# EAGLE design BLAST_TNG_PSD (EAGLE 9.4.2)
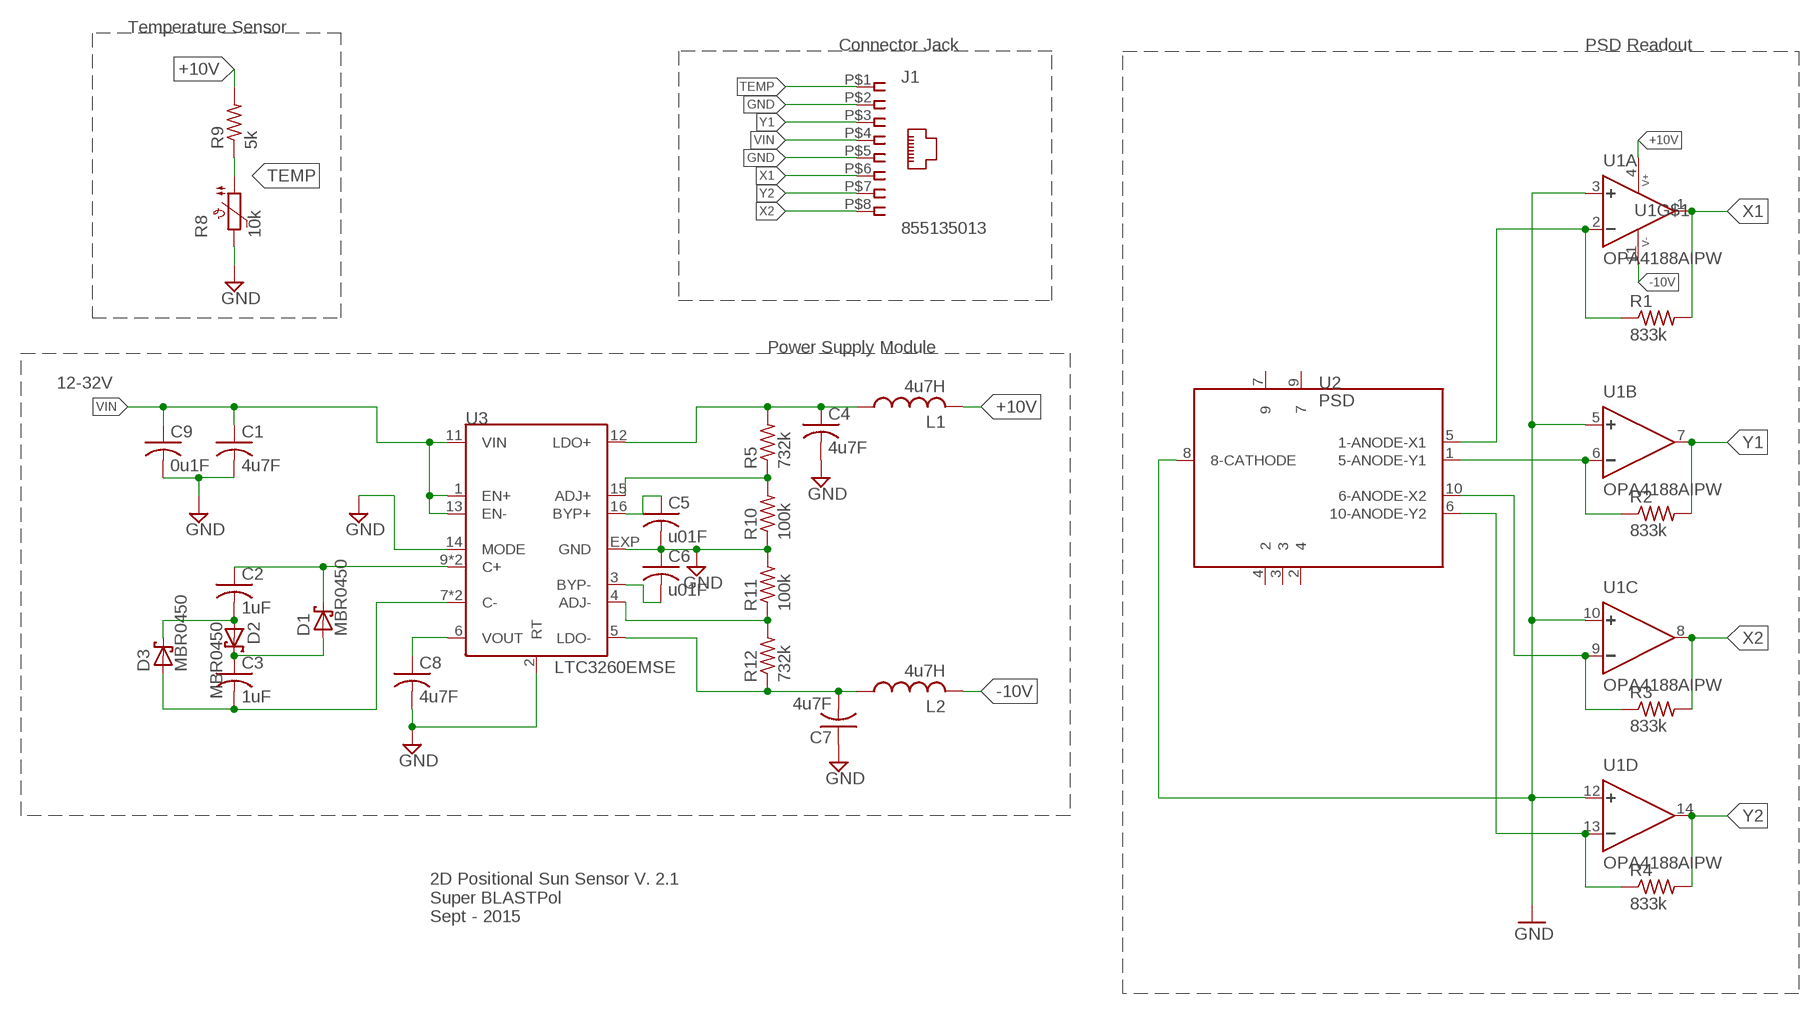
[diagram p0: schematic, sheet 1]

## Parts
C1  4u7F  C-USC1210  [C1210]
C2  1uF  C-USC1206  [C1206]
C3  1uF  C-USC1206  [C1206]
C4  4u7F  C-USC1210  [C1210]
C5  u01F  C-USC0805  [C0805]
C6  u01F  C-USC0805  [C0805]
C7  4u7F  C-USC1210  [C1210]
C8  4u7F  C-USC1210  [C1210]
C9  0u1F  C-USC0805  [C0805]
D1  MBR0450  [SOD123]
D2  MBR0450  [SOD123]
D3  MBR0450  [SOD123]
J1  855135013  [855135013]
L1  4u7H  L-USL2012C  [L2012C]
L2  4u7H  L-USL2012C  [L2012C]
R1  833k  R-US_M0805  [M0805]
R2  833k  R-US_M0805  [M0805]
R3  833k  R-US_M0805  [M0805]
R4  833k  R-US_M0805  [M0805]
R5  732k  R-US_R0805  [R0805]
R8  10k  VISHAY-TFPT1206  [L3216C]
R9  5k  R-US_R0805  [R0805]
R10  100k  R-US_R0805  [R0805]
R11  100k  R-US_R0805  [R0805]
R12  732k  R-US_R0805  [R0805]
U1  OPA4188AIPW  [TSSOP14]
U2  PSD  PSD-S5991  [PSD-S5991]
U3  LTC3260EMSE  [MSOP16]

## Nets
+10V [PWR]: L1.2 R9.2 U1.4(V+)
-10V: L2.2 U1.11(V-)
D1X1: R1.1 U1.2(A:-) U2.5(1-ANODE-X1)
D1X2: R3.1 U1.9(C:-) U2.10(6-ANODE-X2)
D1Y1: R2.1 U1.6(B:-) U2.1(5-ANODE-Y1)
D1Y2: R4.1 U1.13(D:-) U2.6(10-ANODE-Y2)
FLY+: C2.1 D1.C U3.9(C+) U3.10(C+)
FLY-: C3.2 D3.A U3.7(C-) U3.8(C-)
GND [GND]: C1.2 C4.2 C5.2 C6.1 C7.1 C8.2 C9.2 J1.P$2 J1.P$5 R8.2 R10.1 R11.2 U1.3(A:+) U1.5(B:+) U1.10(C:+) U1.12(D:+) U2.8(8-CATHODE) U3.2(RT) U3.14(MODE) U3.EXP(GND)
LDO+ [PWR]: C4.1 L1.1 R5.2 U3.12(LDO+)
LDO-: C7.2 L2.1 R12.1 U3.5(LDO-)
N$4: C8.1 U3.6(VOUT)
N$5: C3.1 D1.A D2.C
N$8: C2.2 D2.A D3.C
N$10: C6.2 U3.3(BYP-)
N$11: C5.1 U3.16(BYP+)
N$12: R5.1 R10.2 U3.15(ADJ+)
N$13: R11.1 R12.2 U3.4(ADJ-)
TEMP: J1.P$1 R8.1 R9.1
VIN [PWR]: C1.1 C9.1 J1.P$4 U3.1(EN+) U3.11(VIN) U3.13(EN-)
X1: J1.P$6 R1.2 U1.1(A:OUT)
X2: J1.P$8 R3.2 U1.8(C:OUT)
Y1: J1.P$3 R2.2 U1.7(B:OUT)
Y2: J1.P$7 R4.2 U1.14(D:OUT)
Unconnected: U2.2 U2.3 U2.4 U2.7 U2.9

## Notes on the sheet
- Temperature Sensor
- Connector Jack | PSD Readout
- Power Supply Module
- 12-32V
- 2D Positional Sun Sensor V. 2.1
  Super BLASTPol
  Sept - 2015

## Library data of the parts
C1 C4 C7 C8 = rcl:C-US: CAPACITOR, American symbol; MPN: CL31A475KOHNNNE; OC_NEWARK: 82AC9497
C2 C3 C5 C6 C9 = rcl:C-US: CAPACITOR, American symbol; OC_NEWARK: unknown
D1-D3 = diode:MBR0450; OC_NEWARK: unknown
J1 = con-molex:855135013; MPN: 85513-5013; OC_NEWARK: 42M3080
L1 L2 = rcl:L-US: INDUCTOR, American symbol; OC_NEWARK: unknown
R1-R4 = adafruit:R-US_: RESISTOR, American symbol; OC_NEWARK: unknown
R5 R9-R12 = rcl:R-US_: RESISTOR, American symbol; OC_NEWARK: unknown
R8 = sunsensor:VISHAY-TFPT; MPN: KPTL-3216CGCK; OC_NEWARK: 46W4593
U1 = texas:OPA4188: Zero-Drift OPERATIONAL AMPLIFIER http://www.ti.com/lit/ds/symlink/opa4188.pdf; OC_NEWARK: unknown
U2 = sunsensor:PSD-S5991; OC_NEWARK: unknown
U3 = linear-technology:LTC3260: Low Noise Dual Supply Inverting Charge Pump https://cds.linear.com/docs/en/datasheet/3260fa.pdf; OC_NEWARK: unknown

## Net classes
0 default: width 0.152 mm, drill 0.152 mm, clearance 0.152 mm
1 GND: width 0.152 mm, drill 0.152 mm, clearance 0.152 mm to class 0, clearance 0.152 mm
2 PWR: width 0.152 mm, drill 0.152 mm, clearance 0.152 mm to class 0, clearance 0.152 mm to class 1, clearance 0.152 mm

## Board
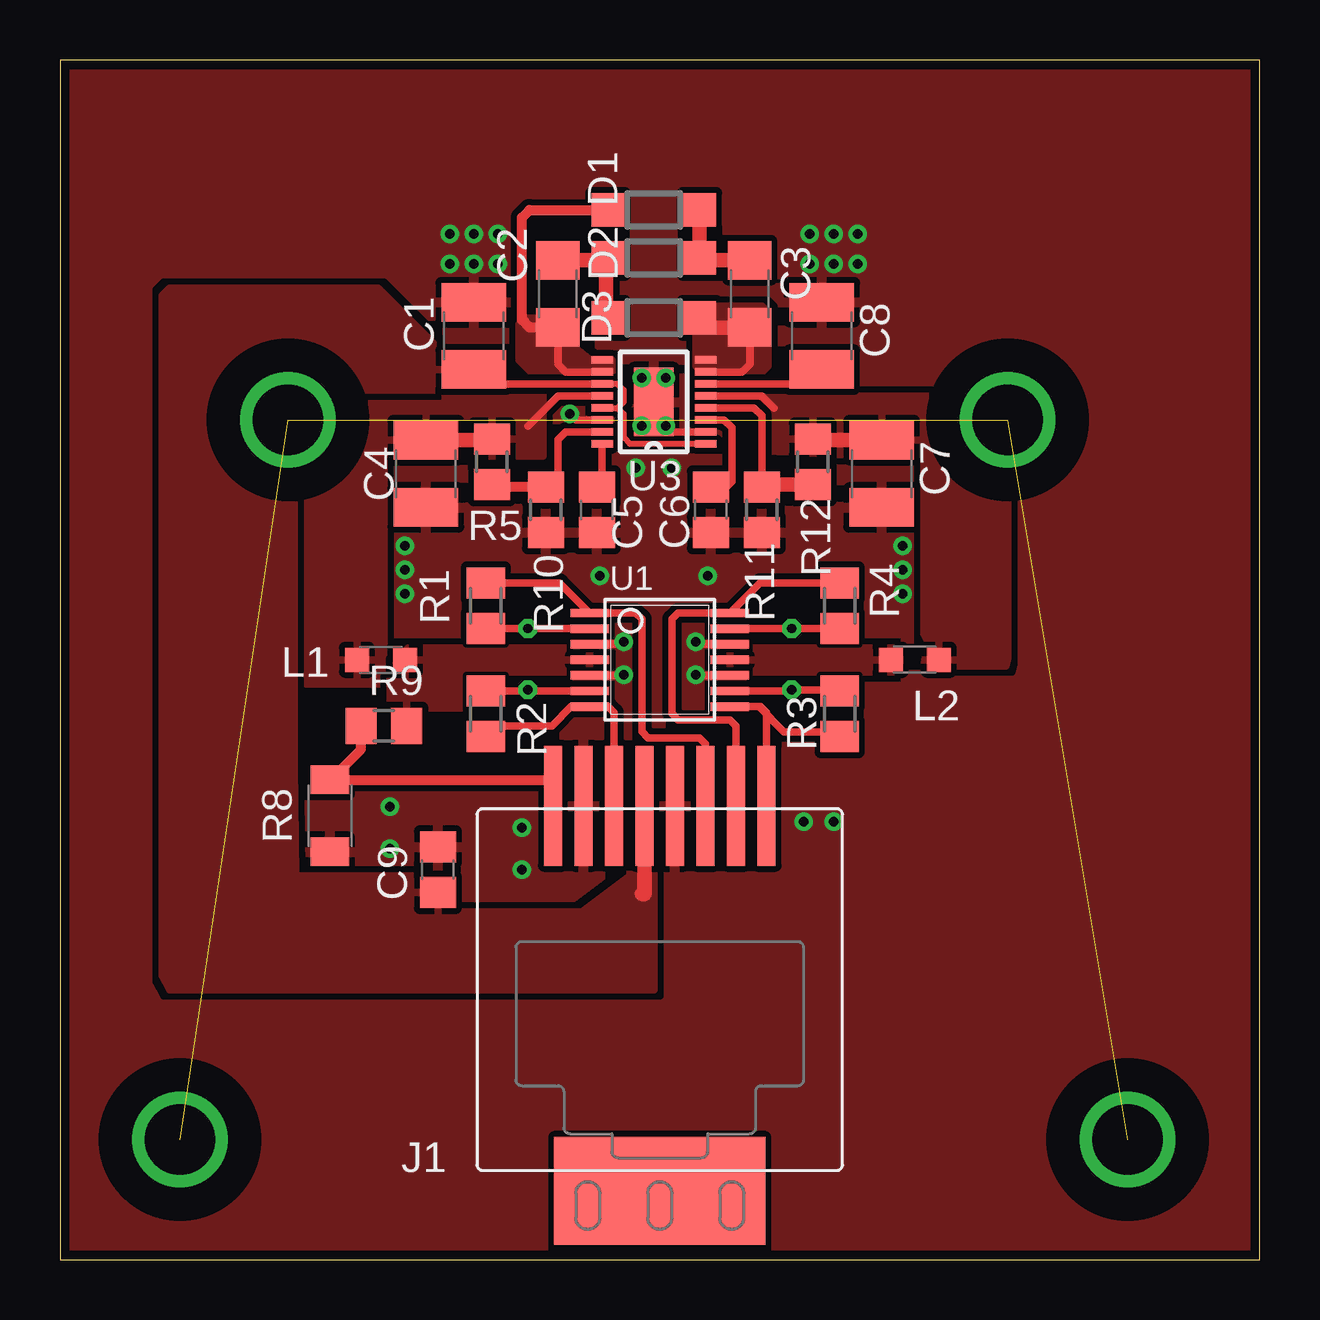
[diagram p1: board, top side]
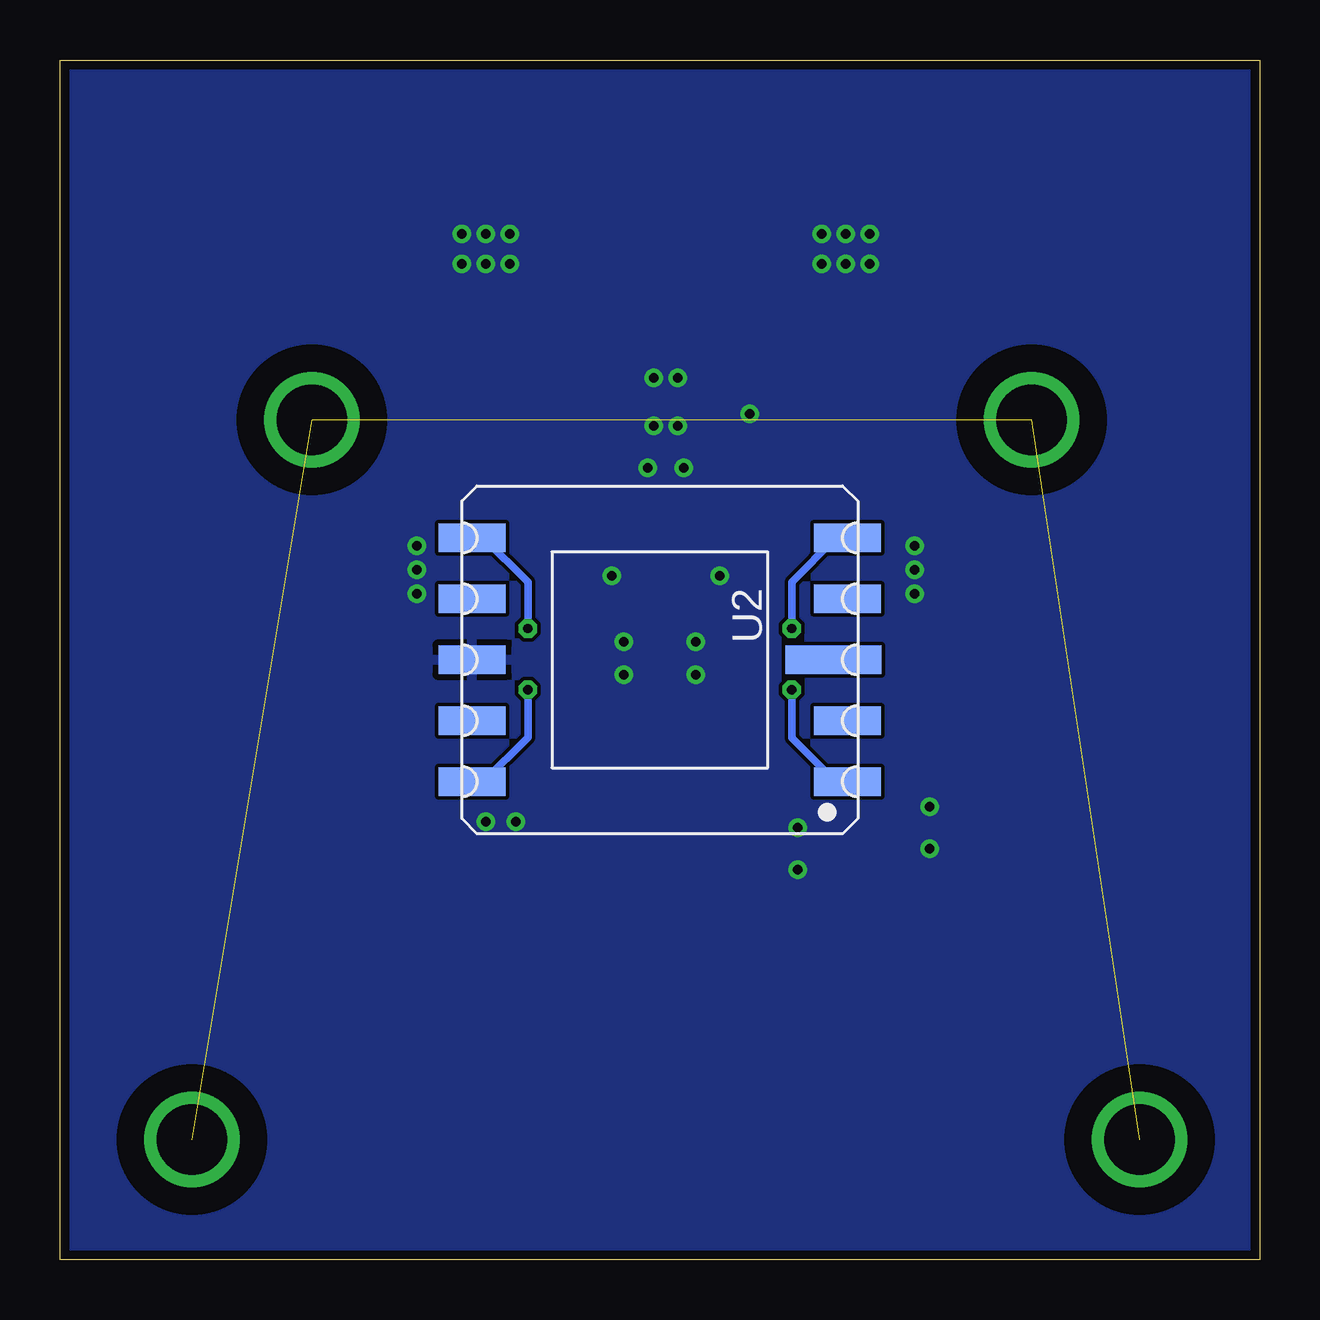
[diagram p2: board, bottom side, seen from below]

Size 50 x 50 mm. Coordinates in mm from the lower left corner, seen from the top.
Outline: 0,0 50,0 50,50 0,50 0,0
Copper layers (1*16): Top 0.035559375mm / dielectric 1.501140625mm / Bottom 0.035559375mm
Design rules "typical_4pcb": minimum track width 10mil, minimum drill 15mil, track to track 6mil, track to pad 6mil, pad to pad 6mil, via to via 6mil, smd to smd 6mil, copper to edge 15mil, drill to drill 8mil, minimum pad ring 10mil, minimum via ring 8mil, stop-mask expansion 4mil, vias tented up to drill 0mil, thermal gap 10mil
tRestrict: area 6.5,32 to 12.5,38; area 7.5,33 to 11.5,37; area 36.5,32 to 42.5,38; area 37.5,33 to 41.5,37; area 2,2 to 8,8; area 3,3 to 7,7; area 41.5,2 to 47.5,8; area 42.5,3 to 46.5,7
bRestrict: area 2,2 to 8,8; area 41.5,2 to 47.5,8; area 36.5,32 to 42.5,38; area 6.5,32 to 12.5,38

### Footprints (pad centres in the part's own frame; a part is rotated, then mirrored left to right if it is on the bottom)
C1210 = smd 1.6 x 2.7: 1 -1.4,0; 2 1.4,0
C1206 = smd 1.6 x 1.8: 1 -1.4,0; 2 1.4,0
C0805 = smd 1.3 x 1.5: 1 -0.95,0; 2 0.95,0
SOD123 = smd 1.4 x 1.4: A 1.9,0; C -1.9,0
855135013 = smd 0.76 x 5: P$1 4.445,-7.66; P$2 3.175,-7.66; P$3 1.905,-7.66; P$4 0.635,-7.66; P$5 -0.635,-7.66; P$6 -1.905,-7.66; P$7 -3.175,-7.66; P$8 -4.445,-7.66 | smd 8.8 x 4.5: STRAIN_REL 0,8.39
L2012C = smd 1 x 1: 1 -1,0; 2 1,0
M0805 = smd 1.3 x 1.6: 1 -0.95,0; 2 0.95,0
R0805 = smd 1.3 x 1.5: 1 -0.95,0; 2 0.95,0
L3216C = smd 1.2 x 1.6: 1 -1.5,0; 2 1.5,0
TSSOP14 = smd 0.35 x 1.6: 1 -1.95,-2.918; 2 -1.3,-2.918; 3 -0.65,-2.918; 4 0,-2.918; 5 0.65,-2.918; 6 1.3,-2.918; 7 1.95,-2.918; 8 1.95,2.918; 9 1.3,2.918; 10 0.65,2.918; 11 0,2.918; 12 -0.65,2.918; 13 -1.3,2.918; 14 -1.95,2.918
PSD-S5991 = smd 1.2 x 2.8: 1 5.08,7.823; 2 2.54,7.823; 4 -2.54,7.823; 5 -5.08,7.823; 6 -5.08,-7.823; 7 -2.54,-7.823; 8 0,-7.823; 9 2.54,-7.823; 10 5.08,-7.823 | smd 1.2 x 4: 3 0,7.239
MSOP16 = smd 0.889 x 0.305: 1 -2.163,1.75; 2 -2.163,1.25; 3 -2.163,0.75; 4 -2.163,0.25; 5 -2.163,-0.25; 6 -2.163,-0.75; 7 -2.163,-1.25; 8 -2.163,-1.75; 9 2.15,-1.75; 10 2.15,-1.25; 11 2.15,-0.75; 12 2.15,-0.25; 13 2.15,0.25; 14 2.15,0.75; 15 2.15,1.25; 16 2.15,1.75 | smd 1.65 x 2.85: EXP 0,0

### Placement (x,y rotation side)
C1  17.25,38.5 90 top
C2  20.75,40.25 90 top
C3  28.75,40.25 270 top
C4  15.25,32.75 270 top
C5  22.38,31.25 270 top
C6  27.12,31.25 90 top
C7  34.25,32.75 90 top
C8  31.75,38.5 90 top
C9  15.75,16.25 90 top
D1  24.75,43.75 0 top
D2  24.75,41.75 180 top
D3  24.75,39.25 0 top
J1  25,11.25 180 top
L1  13.38,25 0 top
L2  35.62,25 180 top
R1  17.75,27.25 90 top
R2  17.75,22.75 270 top
R3  32.5,22.75 270 top
R4  32.5,27.25 90 top
R5  18,33.25 90 top
R8  11.25,18.5 270 top
R9  13.5,22.25 0 top
R10  20.25,31.25 90 top
R11  29.25,31.25 270 top
R12  31.38,33.25 270 top
U1  25,25 270 top
U2  25,25 270 bottom
U3  24.75,35.75 180 top

### Tracks (layer width: path | path; a pad name or v marks a point on that pad's centre or on a via)
+10V
  pour Top: 14.5,25.5 22.75,25.5 22.75,24.5 16.75,24.5 16.75,23 13.75,23 13.75,24.5
-10V
  pour Top: 35,24.5 27.75,24.5 27.5,24.75 27.5,25.25 27.75,25.5 34.5,25.5 34.75,25.5 35,25.25
CASE4  (via drill 2.95)  (3 unrouted)
  other vias: 9.5,35 39.5,35 44.5,5 5,5
D1X1  (via drill 0.38 pad 0.3)
  Top 0.305: U1.2 v19.5,26.3 R1.1
  Bottom 0.305: 17.67,30.08 19.5,28.25 v19.5,26.3
  Bottom 0.406: U2.5 17.67,30.08
D1X2  (via drill 0.38 pad 0.3)
  Top 0.305: U1.9 30.45,23.7 v30.5,23.75 32.45,23.75 R3.1
  Bottom 0.305: 32.35,19.92 30.5,21.77 v30.5,23.75
  Bottom 0.406: U2.10 32.35,19.92
D1Y1  (via drill 0.38 pad 0.3)
  Top 0.305: U1.6 19.55,23.7 v19.5,23.75 19.45,23.7 R2.1
  Bottom 0.305: 17.67,19.92 19.5,21.75 v19.5,23.75
  Bottom 0.406: 17.67,19.92 U2.1
D1Y2  (via drill 0.38 pad 0.3)
  Top 0.305: R4.1 v30.5,26.3 U1.13
  Bottom 0.305: 32.35,30.08 30.5,28.23 v30.5,26.3
  Bottom 0.406: U2.6 32.35,30.08
FLY+
  Top 0.305: U3.10 21.07,37 20.75,37.32 C2.1
  Top 0.406: C2.1 19.57,38.85 19.25,39.17 19.25,43.43 19.57,43.75 D1.C
  pour Top (isolate 0.254, no thermals): 23,37 19.62,37 19.12,37.5 19.12,39 19.5,39.25 21.5,39.25 21.5,38 22.12,37.5 23,37.5
FLY-
  Top 0.305: U3.7 28.43,37 28.75,37.32 C3.2
  Top 0.61: D3.A 26.65,39.17 26.97,38.85 C3.2
  pour Top (isolate 0.254, no thermals): 26.5,37.25 26.5,39.5 26.75,39.75 29.25,39.75 29.5,39.5 29.5,37.25 29.25,37 26.75,37
GND  (via drill 0.38, 0.38 pad 0.3)
  Top 0.305: U3.2 24.75,34.5 24.75,35 | 24.75,35 U3.EXP | U1.3 23.5,25.65 v23.5,25.75 | U1.5 23.5,24.35 v23.5,24.38 | U1.12 26.6,25.65 v26.5,25.75 | U1.10 26.52,24.35 v26.5,24.38 | U3.14 21.5,35 v21.25,35.25 | v24.25,34.75 24.5,34.75 24.75,35
  other vias: 16.25,42.75 17.25,42.75 18.25,42.75 18.25,41.5 17.25,41.5 16.25,41.5 32.25,41.5 31.25,41.5 33.25,41.5 33.25,42.75 32.25,42.75 31.25,42.75 22.5,28.5 27,28.5 19.25,18 19.25,16.25 13.75,17.12 13.75,18.88 14.38,29.75 14.38,28.75 14.38,27.75 35.12,29.75 35.12,28.75 35.12,27.75 32.25,18.25 31,18.25 24.25,36.75 25.25,36.75 25.25,34.75 24,33 25.5,33
  pour Bottom: -2.02,52.34 57.15,53.34 57.15,-1.27 -2.77,-1.77
  pour Top (isolate 0.254, rank 6): -1.77,52.34 57.15,53.34 56.65,51.07 57.15,-1.27 -1.77,-1.27
LDO+
  Top 0.305: 19.5,34.75 20.75,36 U3.12
  Top 0.61: C4.1 17.95,34.15 R5.2
  pour Top (isolate 0.254, rank 2): 10.25,24 13.57,24 13.5,25.32 13.5,33.5 20.12,33.5 20.12,36.38 19.5,36.38 19,36.37 19,36 10.57,35.88 10.25,34.68
LDO-
  Top 0.305: U3.5 29.25,36 29.75,35.5
  Top 0.61: C7.2 31.43,34.15 R12.1
  pour Top (isolate 0.254): 36,24.75 39.43,24.75 39.5,25.07 39.5,34.18 38.68,36 30.75,36 30.75,36.25 30.5,36.5 27,36.5 27,33.82 33.57,33.5 35.68,33.5 36,33.18 36,26.07 36.18,25.75
N$4
  Top 0.305: U3.6 32.1,36.5
  Top 0.406: 32.1,36.5 C8.1
N$5
  Top 0.61: C3.1 26.75,41.65 D2.C D1.A
N$8
  Top 0.61: D2.A 22.75,41.65 | 22.75,41.65 C2.2 | 22.75,41.65 22.75,39.35 D3.C
N$10
  Top 0.305: U3.3 27.68,35 28,34.68 28,32.42 27.68,32.1 C6.2
N$11
  Top 0.305: C5.1 22.6,32.33 U3.16
N$12
  Top 0.305: U3.15 21.07,34.5 20.75,34.18 20.75,32.25
  Top 0.406: 20.75,32.25 20.3,32.25 R10.2 18.35,32.2 R5.1
N$13
  Top 0.305: R11.1 29.25,35.18 28.93,35.5 U3.4
  Top 0.61: R12.2 29.35,32.3 R11.1
TEMP
  Top 0.406: 20.55,19.25 J1.P$1 20.55,20 R8.1 11.28,20 12.55,21.27 R9.1
VIN
  Top 0.254: U3.1 23.75,34 23.5,34.25 23.5,35.25 23.25,35.5 | U3.13 23.25,35.5 | 23.25,35.5 23.5,35.75 23.5,36.25 23.25,36.5 U3.11
  Top 0.305: U3.11 17.4,36.5
  Top 0.406: 17.4,36.5 C1.1
  Top 0.61: J1.P$4 24.36,15.25 24.25,15.25
  pour Top (isolate 0.254): 15.93,37.25 16,37.25 16,38 15.75,38 13.25,40.5 4.57,40.5 4.25,40.18 4.25,11.82 4.57,11.25 24.75,11.25 24.75,16.93 24.68,17.25 23.88,17.12 23.75,16.75 23.75,16 21.75,14.5 16.5,14.5 15,16 9.82,16 9.75,20.57 9.75,35.18 10.32,36.25 16.5,36.25 16.5,36.93
X1
  Top 0.305: R1.2 20.83,28.2 U1.1 24,26.95 24.25,26.7 24.25,22 24.5,21.75 26.65,21.75 26.91,21.5 J1.P$6
X2
  Top 0.305: 29.13,23.05 28.75,23.05 U1.8 | R3.2 32.3,22 30.18,22 29.13,23.05 | J1.P$8 29.45,22.8 29.19,23.05 29.13,23.05
Y1
  Top 0.305: R2.2 18.2,22.25 20.5,22.25 21.3,23.05 U1.7 22.84,23.05 23.09,22.8 J1.P$3
Y2
  Top 0.305: R4.2 29.17,28.2 U1.14 25.75,26.95 25.5,26.7 25.5,22.75 25.75,22.5 27.92,22.5 28.18,22.25 J1.P$7

### Text on the board
tDocu: VIN | +10V | -10V | TEMP / GND / Y1 / VIN / GND / X1 / Y2 / X2 | 1 / 2 / 3 / 4 / 5 / 6 / 7 / 8 | BLASTPol 2-D Sun Sensor / 2015 v2.2 / Input: 10.7V - 32V / Output: 0 - 10V